# EAGLE design IRduino_V1.0 (EAGLE 6.4)
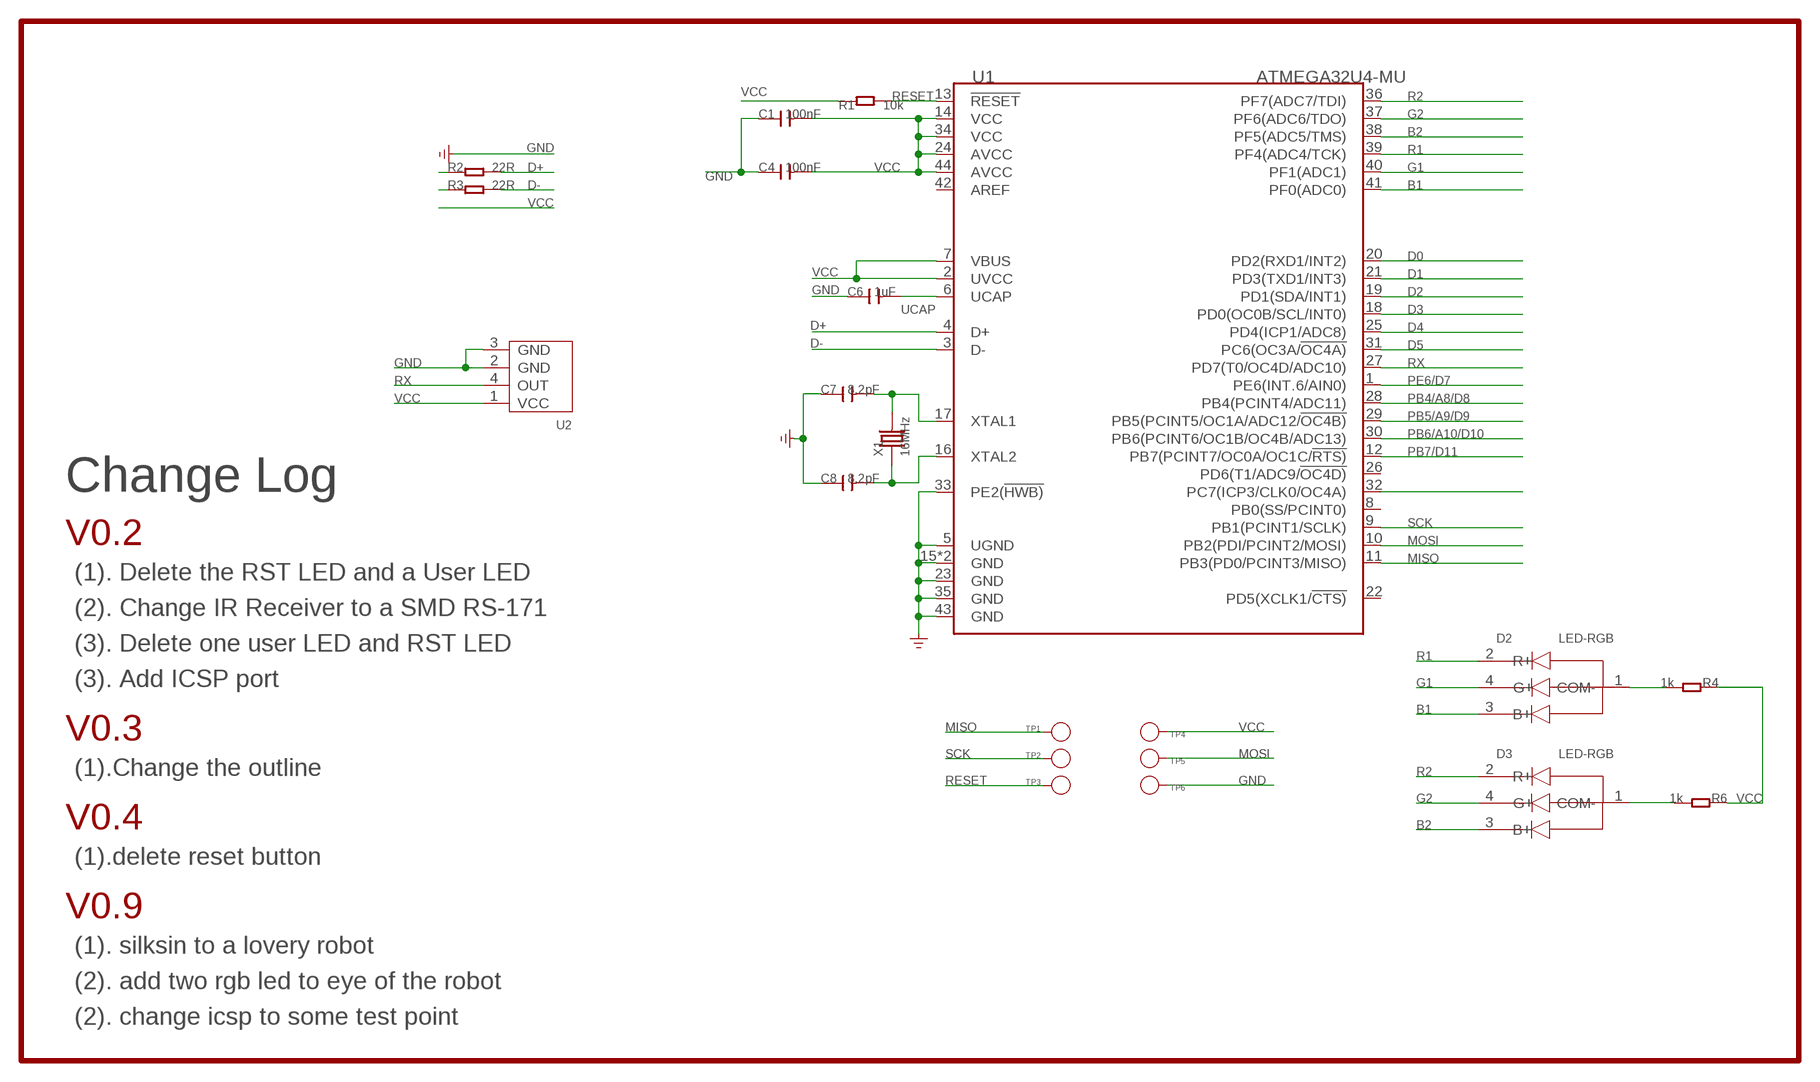
[diagram p0: schematic, sheet 1]

## Parts
C1  100nF  C-0603  [C0603]
C4  100nF  C-0603  [C0603]
C6  1uF  C-0603  [C0603]
C7  8.2pF  C-0603  [C0603]
C8  8.2pF  C-0603  [C0603]
D2  LED-RGB  [4P-SMD-1.6X1.5]
D3  LED-RGB  [4P-SMD-1.6X1.5]
R1  10k  R-0603  [R0603]
R2  22R  R-0603  [R0603]
R3  22R  R-0603  [R0603]
R4  1k  R-0603  [R0603]
R6  1k  R-0603  [R0603]
TP1  PAD-TEST-POINT'3535'  [TP_3535]
TP2  PAD-TEST-POINT'3535'  [TP_3535]
TP3  PAD-TEST-POINT'3535'  [TP_3535]
TP4  PAD-TEST-POINT'3535'  [TP_3535]
TP5  PAD-TEST-POINT'3535'  [TP_3535]
TP6  PAD-TEST-POINT'3535'  [TP_3535]
U1  ATMEGA32U4-MU  [QFN44]
U2  RS-171  [4P-SMD-L7.6*W5.75MM]
X1  16MHz  CRYSTAL'5032'  [2P-SMD-5X3.2]

## Nets
B1: D2.3(B+) U1.41(PF0(ADC0))
B2: D3.3(B+) U1.38(PF5(ADC5/TMS))
D0: U1.20(PD2(RXD1/INT2))
D1: U1.21(PD3(TXD1/INT3))
D2: U1.19(PD1(SDA/INT1))
D3: U1.18(PD0(OC0B/SCL/INT0))
D4: U1.25(PD4(ICP1/ADC8))
D5: U1.31(PC6(OC3A/!OC4A))
D+: R2.2 U1.4(D+)
D++: R2.1
D-: R3.2 U1.3(D-)
D--: R3.1
G1: D2.4(G+) U1.40(PF1(ADC1))
G2: D3.4(G+) U1.37(PF6(ADC6/TDO))
GND [none1]: C1.1 C4.1 C6.1 C7.1 C8.1 TP6.T U1.5(UGND) U1.15(GND) U1.23(GND) U1.33(PE2(!HWB)) U1.35(GND) U1.43(GND) U1.TAB(GND) U2.2(GND) U2.3(GND)
MISO: TP1.T U1.11(PB3(PD0/PCINT3/MISO))
MOSI: TP5.T U1.10(PB2(PDI/PCINT2/MOSI))
N$1: D2.1(COM-) R4.2
N$2: U1.32(PC7(ICP3/CLK0/OC4A))
N$4: D3.1(COM-) R6.2
N$11: C7.2 U1.17(XTAL1) X1.2
N$12: C8.2 U1.16(XTAL2) X1.1
PB4/A8/D8: U1.28(PB4(PCINT4/ADC11))
PB5/A9/D9: U1.29(PB5(PCINT5/OC1A/ADC12/!OC4B))
PB6/A10/D10: U1.30(PB6(PCINT6/OC1B/OC4B/ADC13))
PB7/D11: U1.12(PB7(PCINT7/OC0A/OC1C/!RTS))
PE6/D7: U1.1(PE6(INT.6/AIN0))
R1: D2.2(R+) U1.39(PF4(ADC4/TCK))
R2: D3.2(R+) U1.36(PF7(ADC7/TDI))
RESET: R1.2 TP3.T U1.13(!RESET)
RX: U1.27(PD7(T0/OC4D/ADC10)) U2.4(OUT)
SCK: TP2.T U1.9(PB1(PCINT1/SCLK))
UCAP: C6.2 U1.6(UCAP)
VCC: C1.2 C4.2 R1.1 R4.1 R6.1 TP4.T U1.2(UVCC) U1.7(VBUS) U1.14(VCC) U1.24(AVCC) U1.34(VCC) U1.44(AVCC) U2.1(VCC)
Unconnected: U1.8(PB0(SS/PCINT0)) U1.22(PD5(XCLK1/!CTS)) U1.26(PD6(T1/ADC9/!OC4D)) U1.42(AREF)

## Notes on the sheet
- Change Log
- V0.2
- (1). Delete the RST LED and a User LED
- (2). Change IR Receiver to a SMD RS-171
- (3). Delete one user LED and RST LED
- (3). Add ICSP port
- V0.3
- (1).Change the outline
- V0.4
- (1).delete reset button
- V0.9
- (1). silksin to a lovery robot
- (2). add two rgb led to eye of the robot
- (2). change icsp to some test point

## Library data of the parts
C1 C4 C6-C8 = Discrete:C*: Ceramic Capacitors
D2 D3 = goodman:LED-RGB
R1-R4 R6 = Discrete:R*
TP1-TP6 = Discrete:PAD-TEST-POINT; PARTNO: DNP
U1 = IC:ATMEGA32U4: 8-bit Microcontroller With 16/32K Bytes of ISP Flash and USB controller
U2 = dwin:RS-171
X1 = Discrete:CRYSTAL*: CRYSTAL

## Net classes
0 default: width 0.152 mm, drill 0.305 mm, clearance 0.152 mm
3 none3: width 0.203 mm, drill 0.305 mm, clearance 0.203 mm

## Board
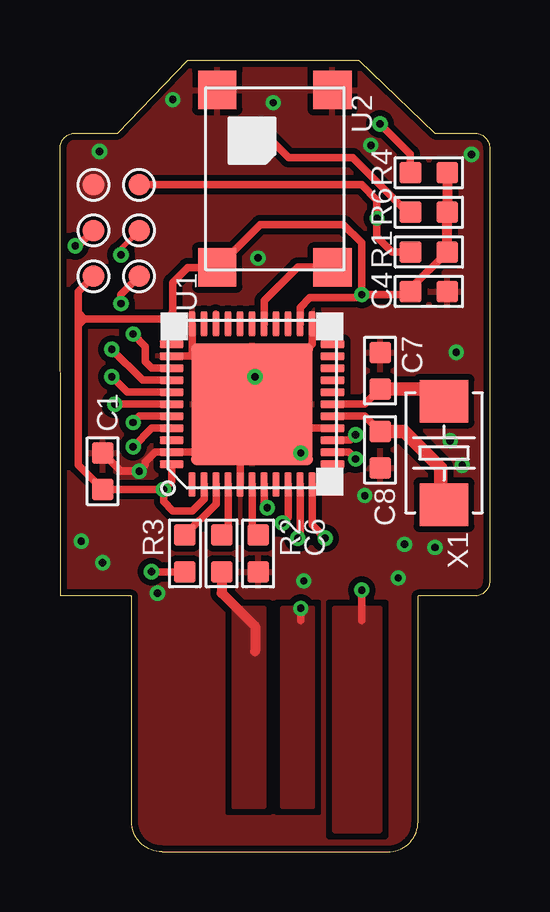
[diagram p1: board, top side]
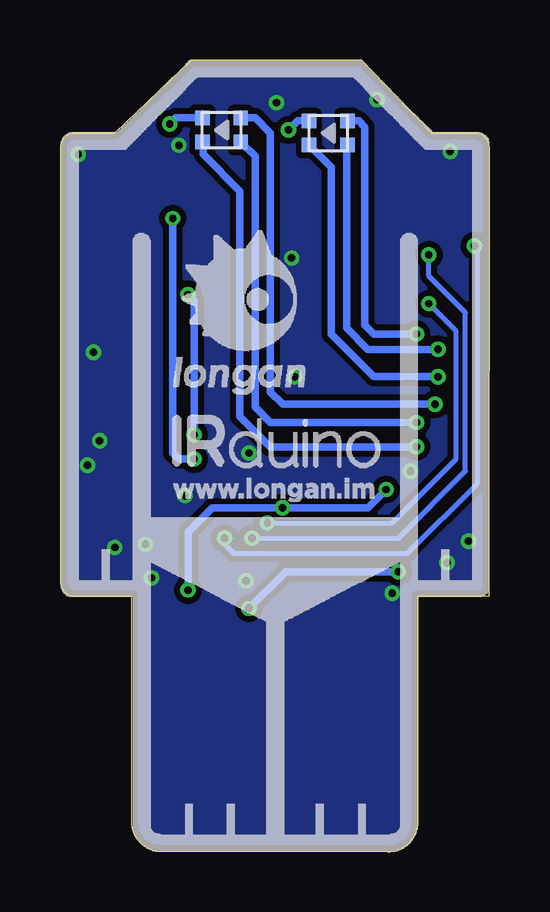
[diagram p2: board, bottom side, seen from below]

Size 17.91 x 33.02 mm. Coordinates in mm from the lower left corner, seen from the top.
Outline: 4.25,0 13.65,0 arc90 14.92,1.27 14.92,10.67 17.27,10.67 arc90 17.91,11.3 17.91,29.34 arc90 17.27,29.97 15.62,29.97 12.45,33.02 5.33,33.02 2.41,29.97 0.64,29.97 arc90 0,29.34 0.02,10.67 2.98,10.67 2.98,1.27 arc90 4.25,0
Copper layers (1*16): Top 0.035mm / dielectric 1.5mm / Bottom 0.035mm
Design rules "SeeedStudio_DRU_no_angle_20130527 *": minimum track width 6mil, minimum drill 12mil, track to track 6mil, track to pad 6mil, pad to pad 6mil, via to via 6mil, smd to smd 0mil, copper to edge 10mil, drill to drill 10mil, minimum pad ring 10mil, minimum via ring 6mil, stop-mask expansion 2mil, vias tented up to drill 25mil, thermal gap 10mil

### Footprints (pad centres in the part's own frame; a part is rotated, then mirrored left to right if it is on the bottom)
C0603 = smd 0.889 x 0.889: 1 -0.762,0; 2 0.762,0
4P-SMD-1.6X1.5 = smd 0.6 x 0.6: 1 0.8,-0.508; 2 -0.8,-0.5; 3 0.8,0.5; 4 -0.8,0.5
R0603 = smd 0.889 x 0.889: 1 -0.762,0; 2 0.762,0
TP_3535 = smd 0.889 x 0.889: T 0,0
QFN44 = smd 1 x 0.3: 1 -3.35,2.5; 2 -3.35,2; 3 -3.35,1.5; 4 -3.35,1; 5 -3.35,0.5; 6 -3.35,0; 7 -3.35,-0.5; 8 -3.35,-1; 9 -3.35,-1.5; 10 -3.35,-2; 11 -3.35,-2.5; 23 3.35,-2.5; 24 3.35,-2; 25 3.35,-1.5; 26 3.35,-1; 27 3.35,-0.5; 28 3.35,0; 29 3.35,0.5; 30 3.35,1; 31 3.35,1.5; 32 3.35,2; 33 3.35,2.5 | smd 0.3 x 1: 12 -2.5,-3.35; 13 -2,-3.35; 14 -1.5,-3.35; 15 -1,-3.35; 16 -0.5,-3.35; 17 0,-3.35; 18 0.5,-3.35; 19 1,-3.35; 20 1.5,-3.35; 21 2,-3.35; 22 2.5,-3.35; 34 2.5,3.35; 35 2,3.35; 36 1.5,3.35; 37 1,3.35; 38 0.5,3.35; 39 0,3.35; 40 -0.5,3.35; 41 -1,3.35; 42 -1.5,3.35; 43 -2,3.35; 44 -2.5,3.35 | smd 5.08 x 5.08: TAB 0,0
4P-SMD-L7.6*W5.75MM = smd 1.6 x 1.6: 1 -3.7,2.4; 2 3.7,2.4; 3 3.7,-2.4; 4 -3.7,-2.4
2P-SMD-5X3.2 = smd 1.778 x 2.032: 1 -2.159,0; 2 2.159,0

### Placement (x,y rotation side)
C1  1.78,15.88 270 top
C4  15.37,23.37 180 top
C6  8.25,12.45 90 top
C7  13.33,20.07 270 top
C8  13.33,16.76 90 top
D2  11.18,30.1 180 bottom
D3  6.73,29.97 180 bottom
R1  15.37,25.02 180 top
R2  6.73,12.45 90 top
R3  5.21,12.45 90 top
R4  15.37,28.32 180 top
R6  15.37,26.67 180 top
TP1  1.4,25.91 0 top
TP2  3.3,24 0 top
TP3  3.3,27.81 0 top
TP4  1.4,24 0 top
TP5  3.3,25.91 0 top
TP6  1.4,27.81 0 top
U1  8,18.67 90 top
U2  8.95,28.07 90 top
X1  16,16.64 90 top

### Tracks (layer width: path | path; a pad name or v marks a point on that pad's centre or on a via)
B1  (via drill 0.3 pad 0.64)
  Top 0.305: U1.41 3.83,17.67 v3.05,16.89
  Bottom 0.305: v3.05,16.89 9.14,16.89 10.41,18.16 10.41,27.56 11.94,29.08 11.94,29.56 D2.3
B2  (via drill 0.3 pad 0.64)
  Top 0.305: U1.38 2.8,19.17 v2.16,19.81
  Bottom 0.305: v2.16,19.81 4.83,19.81 6.6,21.59 6.6,28.55 D3.3
D5
  Top 0.203: U1.31 6.5,22.42 arc45 6.48,22.48
D+
  Top 0.305: U1.4 7,13.48 R2.2
D++
  Top 0.406: R2.1 6.73,10.79 8.13,9.4 8.13,8.38
  pour Top (isolate 0.254, rank 2): 7.24,1.91 8.51,1.91 8.51,10.16 7.24,10.16
D-
  Top 0.305: U1.3 6.5,14.5 R3.2
D--  (via drill 0.3 pad 0.64)
  Top 0.305: R3.1 v3.81,11.68 | v10.03,10.16 10.03,9.65
  Bottom 0.305: v3.81,11.68 8.51,11.68 v10.03,10.16
  pour Top (isolate 0.254, rank 3): 9.27,1.91 10.54,1.91 10.54,10.16 9.27,10.16
G1  (via drill 0.3 pad 0.64)
  Top 0.305: U1.40 3.31,18.17 v3.05,17.91
  Bottom 0.305: v3.05,17.91 9.14,17.91 9.78,18.54 9.78,29 D2.4
G2  (via drill 0.3 pad 0.64)
  Top 0.305: U1.37 3.44,19.67 v2.16,20.95
  Bottom 0.305: v2.16,20.95 5.08,20.95 5.97,21.84 5.97,29.43 D3.4
GND  (via drill 0.3 pad 0.64)
  Top 0.305: U1.5 7.5,17.14 | 7.5,17.14 7.5,17.39 | 7.5,17.39 7.49,17.4 | U1.35 5.46,20.67 | 5.46,20.67 5.68,20.67 5.71,20.7 5.84,20.57 6.98,20.57 7.75,19.81 v8.13,19.81 8.13,18.8 U1.TAB | U1.15 9.64,17.67 8.64,18.67 U1.TAB | 7.5,17.14 7.12,16.76 6.98,16.76 6.89,16.67 U1.43 3.97,16.67 3.56,16.26 3.56,16.13 v3.3,15.88 2.54,15.88 C1.1 | 7.5,17.39 7.5,18.17 U1.TAB | U1.33 5.5,20.71 5.46,20.67 | U1.23 10.5,21.17 10.16,20.83 9.78,20.83 9.52,20.57
  other vias: 14.1,11.43 10.16,11.3 0.89,12.95 12.7,14.86 14.35,12.83 17.14,29.08 8.89,31.24 1.65,29.21 4.7,31.37 1.78,12.06 16.76,16.13 16.26,17.14 15.62,12.7 16.51,20.83 8.25,24.77 12.95,29.46 4.06,10.79 10.03,16.64
  pour Top (isolate 0.254, rank 6): 4.44,0.89 4.44,10.16 6.35,10.16 6.35,0.89
  pour Top (isolate 0.254, rank 6): -0.64,10.54 -0.64,34.54 18.41,34.54 18.41,10.54 15.24,10.67 15.37,-1.4 2.29,-1.4 2.29,10.54
  pour Bottom (isolate 0.254, rank 6): -0.64,10.54 -0.64,34.42 18.29,34.54 18.29,10.67 15.24,10.79 15.24,-1.4 2.16,-1.4 2.16,10.54
MISO  (via drill 0.3 pad 0.64)
  Top 0.305: U1.11 10.5,13.63 v11.05,13.08 | v0.63,25.27 0.76,25.27 TP1.T
  Bottom 0.203: v11.05,13.08 11.05,12.83 10.67,12.45 3.43,12.45 0.51,15.37 0.51,25.15 v0.63,25.27
MOSI  (via drill 0.3 pad 0.64)
  Top 0.203: v2.54,24.89 2.54,25.15 TP5.T
  Top 0.305: U1.10 10,13.18 v9.91,13.08
  Bottom 0.203: v9.91,13.08 3.81,13.08 1.02,15.88 1.02,22.48 2.54,24 v2.54,24.89
N$1  (via drill 0.3 pad 0.64)
  Top 0.305: R4.2 14.6,29.08 v13.33,30.35
  Bottom 0.305: D2.1 13.08,30.61 v13.33,30.35
N$4  (via drill 0.3 pad 0.64)
  Top 0.305: R6.2 14.48,26.67 12.19,28.96 9.52,28.96 v8.38,30.1
  Bottom 0.305: 8.35,30.1 v8.38,30.1 8,30.48 D3.1
N$11
  Top 0.305: U1.17 12.7,18.67 C7.2
  Top 0.559: C7.2 15.49,19.3 X1.2
N$12
  Top 0.305: U1.16 12.69,18.17 C8.2
  Top 0.559: C8.2 14.35,17.53 15.87,16 15.87,14.61 X1.1
R1  (via drill 0.3 pad 0.64)
  Top 0.305: U1.39 v2.29,18.67
  Bottom 0.305: v2.29,18.67 8.64,18.67 9.14,19.18 9.14,29.97 9.78,30.61 10.37,30.61 D2.2
R2  (via drill 0.3 pad 0.64)
  Top 0.305: U1.36 3.83,20.17 3.56,20.45 3.56,21.08 v3.05,21.59
  Bottom 0.305: v3.05,21.59 4.83,21.59 5.21,21.97 5.21,30.23 5.46,30.48 D3.2
RESET  (via drill 0.3 pad 0.58, 0.3 pad 0.64)
  Top 0.305: U1.13 12.03,16.67 v12.32,16.38 | TP3.T 12.57,27.81 13.21,27.18 v13.21,26.42 13.21,25.65 13.84,25.02 R1.2
  Bottom 0.305: v13.21,26.42 13.21,16.64 12.95,16.38 v12.32,16.38
RX
  Top 0.305: U2.4 11.34,24.38 9.91,24.38 8.5,22.98 U1.27
SCK  (via drill 0.3 pad 0.64)
  Top 0.305: v2.54,22.86 2.54,23.24 TP2.T | U1.9 9.5,13.95 v9.27,13.72
  Bottom 0.203: v9.27,13.72 4.06,13.72 1.4,16.38 1.4,21.72 v2.54,22.86
UCAP
  Top 0.305: U1.6 8,13.46 C6.2
VCC  (via drill 0.3 pad 0.64)
  Top 0.305: U1.2 6,14.71 5.52,14.22 4.7,14.22 4.32,14.61 v4.32,15.11 | 4.7,22.48 4.7,23.75 5.32,24.37 U2.1 8.35,26.16 11.81,26.16 12.57,25.4 v12.57,23.24 | 4.7,22.48 4.7,22.23 | 4.7,22.23 4.7,21.97 | 4.7,21.97 4.7,21.22 U1.34 | 0.76,21.97 0.76,22.23 | 0.76,22.23 0.76,22.48 | 0.76,22.48 0.76,23.37 TP4.T | U1.7 8.5,14.49 v8.64,14.35 | U1.44 4.65,15.45 v4.32,15.11 | U1.24 10,22.7 10.41,23.11 12.45,23.11 v12.57,23.24 | v12.32,17.4 12.09,17.17 U1.14 | 4.7,22.23 4.44,22.23 | 4.44,22.23 1.02,22.23 | 1.02,22.23 0.76,22.23 | 4.7,22.48 4.44,22.23 | 4.7,21.97 4.44,22.23 | 1.02,22.23 0.76,22.48 | 0.76,21.97 1.02,22.23 | 0.76,21.97 0.76,16.13 C1.2 v4.32,15.11 | v12.57,23.24 14.48,23.24 C4.2 14.6,23.5 R1.1 | v12.57,10.92 12.57,9.65
  Top 0.406: R1.1 R6.1 R4.1
  Bottom 0.305: v4.32,15.11 5.08,14.35 v8.64,14.35 11.56,14.35 12.57,13.34 v12.57,10.92 | v12.32,17.4 12.32,22.99 v12.57,23.24
  pour Top (isolate 0.254): 13.33,0.89 13.33,10.16 11.43,10.16 11.43,0.89